# Altium schematic sheet PDOC - AMS.SchDoc
size Letter
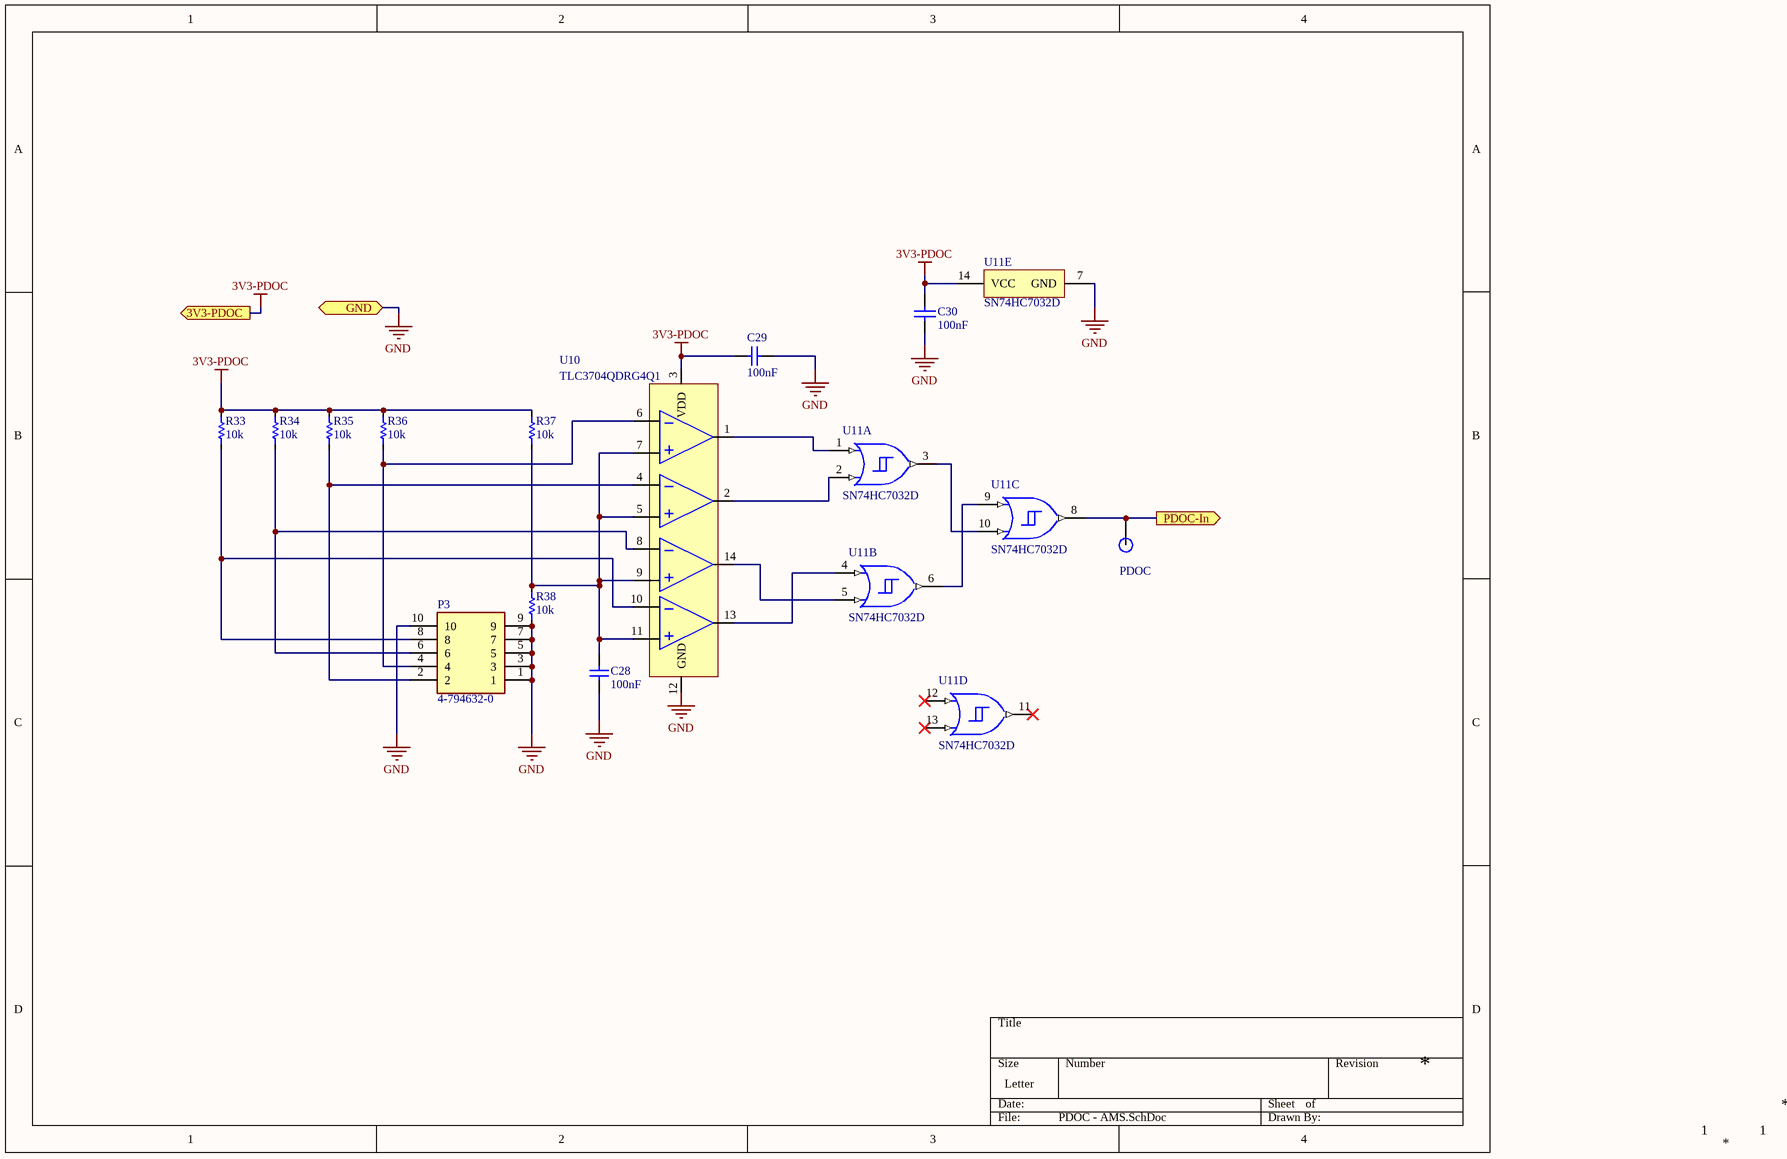
[diagram p0: PDOC - AMS.SchDoc]

## Parts
C28  value 100nF  [C_0603]  (hidden comment: C0603C104K3RAC7013)
C29  value 100nF  [C_0603]  (hidden comment: C0603C104K3RAC7013)
C30  value 100nF  [CAP0603]  (hidden comment: C0603C104K3RAC7013)
P3  4-794632-0  [SHDR10W82P300_2X5_1586X686X944P]
PDOC  1.2mm Test point  [Test Point]  (value not drawn)  (no BOM)
R33  value 10k  [R-0603]  (hidden comment: RC0603FR-1310KL)
R34  value 10k  [R-0603]  (hidden comment: RC0603FR-1310KL)
R35  value 10k  [R-0603]  (hidden comment: RC0603FR-1310KL)
R36  value 10k  [R-0603]  (hidden comment: RC0603FR-1310KL)
R37  value 10k  [R-0603]  (hidden comment: RC0603FR-1310KL)
R38  value 10k  [R-0603]  (hidden comment: RC0603FR-1310KL)
U10  TLC3704QDRG4Q1  [SOIC127P600X175-14N]
U11  SN74HC7032D  [D0014A_L]  (parts A,B,C,D,E of 5)

## Ports
3V3-PDOC (out), GND (bidir), PDOC-In (out)

## Nets
3V3-PDOC: C29.2 C30.2 R33.2 R34.2 R35.2 R36.2 R37.2 U10.3(VDD) U11.14(VCC) ; port 3V3-PDOC
GND: C28.1 C29.1 C30.1 P3.1 P3.3 P3.5 P3.7 P3.9 P3.10 R38.1 U10.12(GND) U11.7(GND) ; port GND
PDOC-In: PDOC.1 U11.8(3Y) ; port PDOC-In
NetC28_2: C28.2 R37.1 R38.2 U10.5(In2+) U10.7(In1+) U10.9(In3+) U10.11(In4+)
NetP3_2: P3.2 R35.1 U10.4(In2-)
NetP3_4: P3.4 R36.1 U10.6(In1-)
NetP3_6: P3.6 R34.1 U10.8(In3-)
NetP3_8: P3.8 R33.1 U10.10(In4-)
NetU10_1: U10.1(Out1) U11.1(1A)
NetU10_2: U10.2(Out2) U11.2(1B)
NetU10_13: U10.13(Out4) U11.4(2A)
NetU10_14: U10.14(Out3) U11.5(2B)
NetU11_3: U11.3(1Y) U11.10(3B)
NetU11_6: U11.6(2Y) U11.9(3A)

Not connected (* = marked no-connect by the designer): U11 11(4Y)* 12(4A)* 13(4B)*

## Notes on the sheet
- 1

## Library data of the parts
C28 C29 = Capacitor: ComponentLink1Description: New link; ComponentLink1URL: *
C30 = Cap: Published: 8-Jun-2000; LatestRevisionDate: 17-Jul-2002; LatestRevisionNote: Re-released for DXP Platform.; PackageReference: RAD-0.3; Publisher: Altium Limited; PackageDescription: Radial Cap, Thru-Hole; 2 Leads; 0.3 in Pin Spacing
P3 = 4-794632-0: Connector; Manufacturer_Name: TE Connectivity; Datasheet Link: https://www.mouser.com/ProductDetail/TE-Connectivity-AMP/4-794632-0?qs=Rd%252BN518myCyGOpGRvqIhCg%3D%3D; Height: 9.44mm; Manufacturer_Part_Number: 4-794632-0; Mouser Part Number: 571-4-794632-0; Mouser Price/Stock: https://www.mouser.co.uk/ProductDetail/TE-Connectivity-AMP/4-794632-0?qs=Rd%252BN518myCyGOpGRvqIhCg%3D%3D
PDOC = Test Point
R33-R38 = Resistor
U10 = TLC3704QDRG4Q1: IC VOLT COMPARATOR QUAD 14-SOIC; Manufacturer 1: Texas Instruments; Common Mode Rejection Ratio: 84dB; Min Supply Voltage: 3V; Max Supply Voltage: 16V; Operating Supply Voltage: 5V; Nominal Supply Current: 80uA; Max Power Dissipation: 950mW; Number of Elements: 4; Input Offset Voltage (Vos): 5mV; Input Bias Current: 5pA; Output Current: 20mA; Quiescent Current: 175uA; Propagation Delay: 4.5us; Response Time: 0.3us; Power Supply Rejection Ratio (PSRR): 85dB; Output Type: TTL; Supplier 1: Digi-Key; Supplier Part Number 1: 296-23711-1-ND; Manufacturer Part Number 1: TLC3704QDRG4Q1; Stock 1: 3794; Pricing 1: 1=1.68000, 10=1.50700, 100=1.21100, 500=0.99498, 1000=0.82441 (USD); RoHS: Yes; Mount: Surface Mount; Case/Package: SOIC; Number of Pins: 14; Weight: 0.004318oz; Contact Plating: Gold; Min Operating Temperature: -40°C; Max Operating Temperature: 125°C; Packaging: Tape and Reel; Package Quantity: 2500; Max Supply Current: 80uA; Number of Bits: 4; Number of Channels: 4; Max Input Current: 5pA; Power Dissipation: 950mW; Type: General Purpose; Radiation Hardening: No; Lead Free: Lead Free; ComponentLink1URL: https://datasheet.ciiva.com/1828/tlc3704-q1-1828544.pdf?src-supplier=Digi-Key; ComponentLink1Description: https://datasheet.ciiva.com/1828/tlc3704-q1-1828544.pdf?src-supplier=Digi-Key; ComponentLink2URL: https://datasheet.ciiva.com/4464/sgls191a-104586-4464808.pdf?src-supplier=Mouser; ComponentLink2Description: https://datasheet.ciiva.com/4464/sgls191a-104586-4464808.pdf?src-supplier=Mouser; ComponentLink3URL: https://datasheet.ciiva.com/15131/getdatasheetpartid-331461-15131244.pdf?src-supplier=Verical; ComponentLink3Description: https://datasheet.ciiva.com/15131/getdatasheetpartid-331461-15131244.pdf?src-supplier=Verical; ComponentLink4URL: https://datasheet.ciiva.com/14391/tlc3704-q1-14391948.pdf?src-supplier=Avnet; ComponentLink4Description: https://datasheet.ciiva.com/14391/tlc3704-q1-14391948.pdf?src-supplier=Avnet; ComponentLink5URL: https://datasheet.ciiva.com/1828/tlc3704-q1-1828542.pdf?src-supplier=Digi-Key; ComponentLink5Description: https://datasheet.ciiva.com/1828/tlc3704-q1-1828542.pdf?src-supplier=Digi-Key; ComponentLink6URL: https://datasheet.ciiva.com/1828/tlc3704-q1-1828543.pdf?src-supplier=Digi-Key; ComponentLink6Description: https://datasheet.ciiva.com/1828/tlc3704-q1-1828543.pdf?src-supplier=Digi-Key
U11 = CMP-0781-00002-4: Quadruple Positive-OR Gates With Schmitt-Trigger Inputs, D0014A, TUBE; Manufacturer: Texas Instruments; Output Drive (IOL/IOH)(Max)(mA): 5.2/-5.2; Output Type: CMOS; Bits(#): 4; Rating: Catalog; VCC(Max)(V): 6; VCC(Min)(V): 2; ICC @ Nom Voltage(Max)(mA): 0.02; Voltage(Nom)(V): 5; tpd @ Nom Voltage(Max)(ns): 33; F @ Nom Voltage(Max)(Mhz): 70; Code_JEDEC: MS-012; Generic Part Number: SN74HC7032; PackageReference: D0014A; DatasheetVersion: SCLS036E; PackageVersion: http://www.ti.com/lit/ml/mpds177g/mpds177g.pdf; Operating Temperature Range(C): -40 to 85; Input Type: CMOS